# Altium schematic sheet roll_motorl_control.SchDoc
size A3; DocumentNumber: 7; Revision: V1.0; SheetNumber: 7; SheetTotal: 9
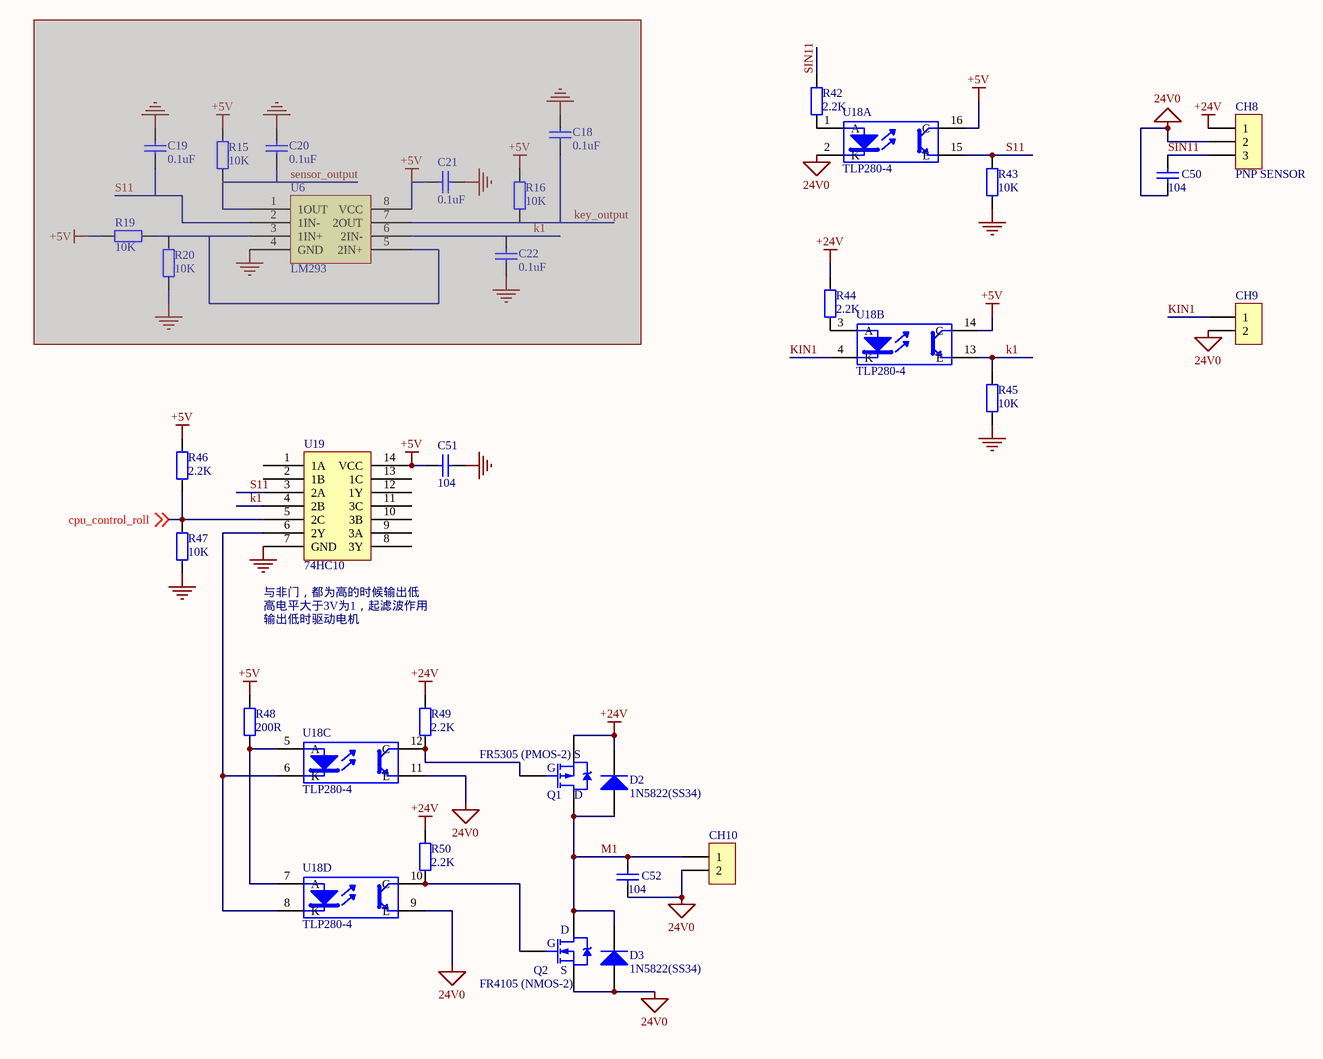
[diagram p0: roll_motorl_control.SchDoc]

## Parts
C18  value 0.1uF  [0805]  (hidden comment: Cap)  (masked out: inside a compile mask, not in the netlist)
C19  value 0.1uF  [0805]  (hidden comment: Cap)  (masked out: inside a compile mask, not in the netlist)
C20  value 0.1uF  [0805]  (hidden comment: Cap)  (masked out: inside a compile mask, not in the netlist)
C21  value 0.1uF  [0805]  (hidden comment: Cap)  (masked out: inside a compile mask, not in the netlist)
C22  value 0.1uF  [0805]  (hidden comment: Cap)  (masked out: inside a compile mask, not in the netlist)
C50  value 104  [0805]  (hidden comment: Cap)
C51  value 104  [0805]  (hidden comment: Cap)
C52  value 104  [0805]  (hidden comment: Cap)
CH8  HEADER1X3  [CH3.96-3PIN]  (value not drawn)
CH9  HEADER1X2  [CH3.96-2PIN]  (value not drawn)
CH10  HEADER1X2  [CH3.96-2PIN]  (value not drawn)
D2  1N5822(SS34)  [SMA]
D3  1N5822(SS34)  [SMA]
Q1  FR5305 (PMOS-2)  [TO-252]
Q2  FR4105 (NMOS-2)  [TO-252]
R15  value 10K  [0805]  (hidden comment: Res2)  (masked out: inside a compile mask, not in the netlist)
R16  value 10K  [0805]  (hidden comment: Res2)  (masked out: inside a compile mask, not in the netlist)
R19  value 10K  [0805]  (hidden comment: Res2)  (masked out: inside a compile mask, not in the netlist)
R20  value 10K  [0805]  (hidden comment: Res2)  (masked out: inside a compile mask, not in the netlist)
R42  value 2.2K  [0805]  (hidden comment: Res2)
R43  value 10K  [0805]  (hidden comment: Res2)
R44  value 2.2K  [0805]  (hidden comment: Res2)
R45  value 10K  [0805]  (hidden comment: Res2)
R46  value 2.2K  [0805]  (hidden comment: Res2)
R47  value 10K  [0805]  (hidden comment: Res2)
R48  value 200R  [0805]  (hidden comment: Res2)
R49  value 2.2K  [0805]  (hidden comment: Res2)
R50  value 2.2K  [0805]  (hidden comment: Res2)
U6  LM293  [SOP8-OP27]  (masked out: inside a compile mask, not in the netlist)
U18  TLP280-4  [SO16]  (parts A,B,C,D of 4)
U19  74HC10  [SO14]

## Nets
24V0: C50.1 C52.1 CH8.2 CH9.2 CH10.2 D3.1(A) Q2.3(S) U18.2(K) U18.9(E) U18.11(E)
+5V: C51.2 R46.1 R48.1 U18.14(C) U18.16(C) U19.14(VCC)
+24V: CH8.1 D2.2(K) Q1.3(S) R44.1 R49.1 R50.1
GND: C51.1 R43.2 R45.2 R47.2 U19.7(GND)
cpu_control_roll: R46.2 R47.1 U19.5(2C) ; off-sheet cpu_control_roll
k1: R45.1 U18.13(E) U19.4(2B)
KIN1: CH9.1 U18.4(K)
M1: C52.2 CH10.1 D2.1(A) D3.2(K) Q1.2(D) Q2.2(D)
S11: R43.1 U18.15(E) U19.3(2A)
SIN11: C50.2 CH8.3 R42.1
NetQ1_1: Q1.1(G) R49.2 U18.12(C)
NetQ2_1: Q2.1(G) R50.2 U18.10(C)
NetR42_2: R42.2 U18.1(A)
NetR44_2: R44.2 U18.3(A)
NetR48_2: R48.2 U18.5(A) U18.7(A)
NetU18_6: U18.6(K) U18.8(K) U19.6(2Y)

Not connected (* = marked no-connect by the designer): U19 1(1A) 2(1B) 8(3Y) 9(3A) 10(3B) 11(3C) 12(1Y) 13(1C)

## Notes on the sheet
- (near U19) 与非门，都为高的时候输出低
- 高电平大于3V为1，起滤波作用
- 输出低时驱动电机
- (near Q1) G
- (near Q1) S
- (near Q1) D
- (near Q2) G
- (near Q2) D
- (near Q2) S
- :
- (in symbol HEADER1X3) PNP SENSOR

## Library data of the parts
C18-C22 C50-C52 = Cap: Capacitor; Published: 8-Jun-2000; LatestRevisionDate: 17-Jul-2002; LatestRevisionNote: Re-released for DXP Platform.; PackageReference: RAD-0.3; Publisher: Altium Limited
D2 D3 = Diode 1N4148: High Conductance Fast Diode; Published: 8-Jun-2000; LatestRevisionDate: 17-Jul-2002; LatestRevisionNote: Re-released for DXP Platform.; DatasheetDocument: 1997; PackageReference: DO-35; Publisher: Altium Limited; Code_JEDEC: DO-204-AH; ComponentLink1Description: Manufacturer Link; ComponentLink1URL: http://www.fairchildsemi.com/; ComponentLink2Description: Datasheet; ComponentLink2URL: http://www.fairchildsemi.com/ds/1N%2F1N4148.pdf
Q1 = PMOS-2: P-Channel Power MOSFET; Note: Pin 4 not drawn and electrically connected to Pin 2.; Published: 8-Jun-2000; LatestRevisionDate: 17-Jul-2002; LatestRevisionNote: Re-released for DXP Platform.; DatasheetDocument: PD-9.390D; PackageReference: TO-220AB; Publisher: Altium Limited; Code_JEDEC: TO-220-AB; ComponentLink1Description: Manufacturer Link; ComponentLink1URL: http://www.irf.com/
Q2 = NMOS-2: N-Channel Power MOSFET; Note: Pin 2 is electrically connected to pin 4.; Published: 8-Jun-2000; LatestRevisionDate: 17-Jul-2002; LatestRevisionNote: Re-released for DXP Platform.; DatasheetDocument: PD-9.814; PackageReference: TO-220AB; Publisher: Altium Limited; Code_JEDEC: TO-220-AB; ComponentLink1Description: Manufacturer Link; ComponentLink1URL: http://www.irf.com/
R15 R16 R19 R20 R42-R50 = Res2: Resistor; Published: 8-Jun-2000; LatestRevisionDate: 17-Jul-2002; LatestRevisionNote: Re-released for DXP Platform.; PackageReference: AXIAL-0.4; Publisher: Altium Limited
U18 = TLP521-4
U19 = 74HC10: three input nand gain